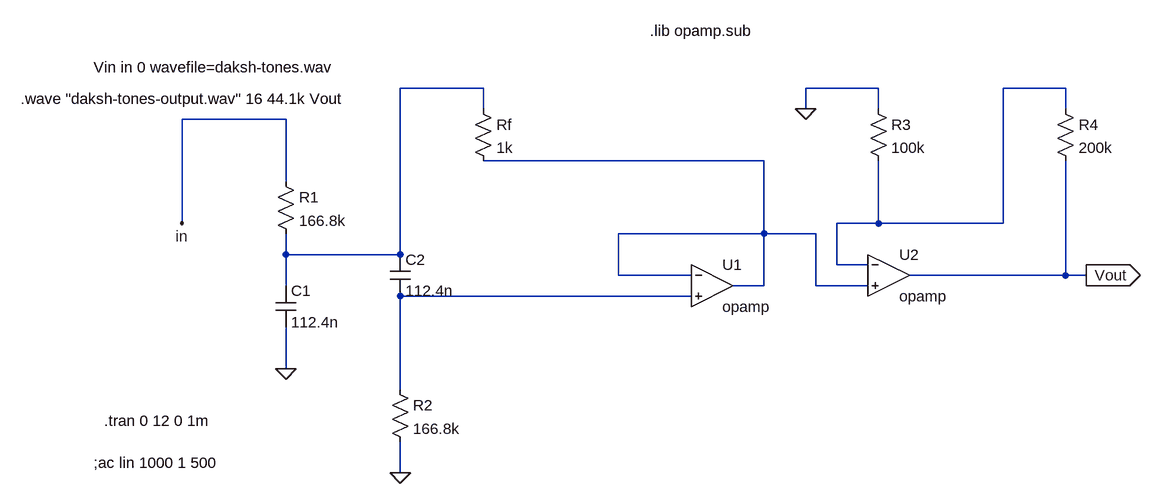
[diagram p0: schematic Draft1.asc]
Draft1.asc, the LTspice schematic file:
Version 4
SHEET 1 1024 680
WIRE -16 -288 -144 -288
WIRE 592 -288 480 -288
WIRE 880 -288 784 -288
WIRE -16 -256 -16 -288
WIRE 480 -256 480 -288
WIRE 592 -256 592 -288
WIRE 880 -256 880 -288
WIRE -320 -240 -480 -240
WIRE 416 -176 -16 -176
WIRE -320 -144 -320 -240
WIRE -480 -80 -480 -240
WIRE 592 -80 592 -176
WIRE 592 -80 528 -80
WIRE 784 -80 784 -288
WIRE 784 -80 592 -80
WIRE 416 -64 416 -176
WIRE 416 -64 192 -64
WIRE 496 -64 416 -64
WIRE -320 -32 -320 -64
WIRE -144 -32 -144 -288
WIRE -144 -32 -320 -32
WIRE 528 -16 528 -80
WIRE 576 -16 528 -16
WIRE 192 0 192 -64
WIRE 304 0 192 0
WIRE 880 0 880 -176
WIRE 880 0 640 0
WIRE 912 0 880 0
WIRE -320 16 -320 -32
WIRE 416 16 416 -64
WIRE 416 16 368 16
WIRE 496 16 496 -64
WIRE 576 16 496 16
WIRE 304 32 -144 32
WIRE -320 144 -320 80
WIRE -144 176 -144 32
WIRE -144 304 -144 256
FLAG -320 144 0
FLAG -144 304 0
FLAG 480 -256 0
FLAG -480 -80 in
FLAG 912 0 Vout
IOPIN 912 0 Out
SYMBOL res 576 -272 R0
SYMATTR InstName R3
SYMATTR Value 100k
SYMBOL res -32 -272 R0
SYMATTR InstName Rf
SYMATTR Value 1k
SYMBOL res 864 -272 R0
SYMATTR InstName R4
SYMATTR Value 200k
SYMBOL res -336 -160 R0
SYMATTR InstName R1
SYMATTR Value 166.8k
SYMBOL cap -336 16 R0
SYMATTR InstName C1
SYMATTR Value 112.4n
SYMBOL cap -160 -32 R0
SYMATTR InstName C2
SYMATTR Value 112.4n
SYMBOL OpAmps\\opamp 336 -48 R0
SYMATTR InstName U1
SYMBOL OpAmps\\opamp 608 -64 R0
SYMATTR InstName U2
SYMBOL res -160 160 R0
SYMATTR InstName R2
SYMATTR Value 166.8k
TEXT -616 288 Left 2 !;ac lin 1000 1 500
TEXT 240 -376 Left 2 !.lib opamp.sub
TEXT -616 -320 Left 2 !Vin in 0 wavefile=daksh-tones.wav
TEXT -600 224 Left 2 !.tran 0 12 0 1m
TEXT -728 -272 Left 2 !.wave "daksh-tones-output.wav" 16 44.1k Vout

The netlist it stands for:
* Draft1.asc
R3 0 N002 100k
Rf N001 N003 1k
R4 N002 Vout 200k
R1 in N001 166.8k
C1 N001 0 112.4n
C2 N001 N004 112.4n
XU1 N003 N004 N003 opamp Aol=100K GBW=10Meg  ; pins invin noninvin out
XU2 N002 N003 Vout opamp Aol=100K GBW=10Meg  ; pins invin noninvin out
R2 N004 0 166.8k
;ac lin 1000 1 500
.lib opamp.sub
Vin in 0 wavefile=daksh-tones.wav
.tran 0 12 0 1m
.wave "daksh-tones-output.wav" 16 44.1k Vout
.backanno
.end